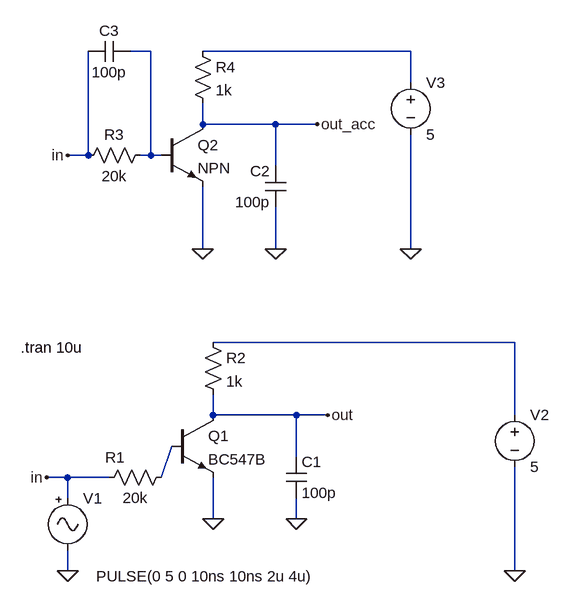
[diagram p0: schematic 3.7.asc]
3.7.asc, the LTspice schematic file:
Version 4
SHEET 1 880 936
WIRE 16 -32 -16 -32
WIRE 416 -32 96 -32
WIRE 416 16 416 -32
WIRE 96 80 96 48
WIRE 208 80 96 80
WIRE 272 80 208 80
WIRE -80 128 -80 -32
WIRE -80 128 -112 128
WIRE 16 128 16 -32
WIRE 16 128 0 128
WIRE 32 128 16 128
WIRE 208 144 208 80
WIRE 96 272 96 176
WIRE 208 272 208 208
WIRE 416 272 416 96
WIRE 576 416 112 416
WIRE 112 528 112 496
WIRE 240 528 112 528
WIRE 288 528 240 528
WIRE 576 528 576 416
WIRE 240 592 240 528
WIRE -112 624 -144 624
WIRE -48 624 -112 624
WIRE 32 624 48 576
WIRE -112 656 -112 624
WIRE 112 688 112 624
WIRE 240 688 240 656
WIRE -112 768 -112 736
WIRE 576 768 576 608
FLAG 96 272 0
FLAG 208 272 0
FLAG 416 272 0
FLAG -112 128 in
FLAG 272 80 out_acc
FLAG -112 768 0
FLAG 112 688 0
FLAG 240 688 0
FLAG 576 768 0
FLAG -144 624 in
FLAG 288 528 out
SYMBOL res 16 112 R90
WINDOW 0 0 56 VBottom 2
WINDOW 3 32 56 VTop 2
SYMATTR InstName R3
SYMATTR Value 20k
SYMBOL res 80 -48 R0
SYMATTR InstName R4
SYMATTR Value 1k
SYMBOL voltage 416 0 R0
WINDOW 123 0 0 Left 2
WINDOW 39 0 0 Left 2
SYMATTR InstName V3
SYMATTR Value 5
SYMBOL cap 224 208 R180
WINDOW 0 24 56 Left 2
WINDOW 3 24 8 Left 2
SYMATTR InstName C2
SYMATTR Value 100p
SYMBOL npn 32 80 R0
SYMATTR InstName Q2
SYMBOL cap -16 -48 R90
WINDOW 0 0 32 VBottom 2
WINDOW 3 32 32 VTop 2
SYMATTR InstName C3
SYMATTR Value 100p
SYMBOL Misc\\signal -112 640 R0
WINDOW 123 0 0 Left 2
WINDOW 39 0 0 Left 2
WINDOW 3 44 136 Left 2
SYMATTR InstName V1
SYMATTR Value PULSE(0 5 0 10ns 10ns 2u 4u)
SYMBOL res 48 608 R90
WINDOW 0 1 87 VBottom 2
WINDOW 3 32 56 VTop 2
SYMATTR InstName R1
SYMATTR Value 20k
SYMBOL res 96 400 R0
SYMATTR InstName R2
SYMATTR Value 1k
SYMBOL voltage 576 512 R0
WINDOW 123 0 0 Left 2
WINDOW 39 0 0 Left 2
SYMATTR InstName V2
SYMATTR Value 5
SYMBOL cap 224 592 R0
SYMATTR InstName C1
SYMATTR Value 100p
SYMBOL npn 48 528 R0
SYMATTR InstName Q1
SYMATTR Value BC547B
TEXT -184 424 Left 2 !.tran 10u

The netlist it stands for:
* 3.7.asc
R3 N001 in 20k
R4 N002 out_acc 1k
V3 N002 0 5
C2 0 out_acc 100p
Q2 out_acc N001 0 0 NPN
C3 N001 in 100p
V1 in 0 PULSE(0 5 0 10ns 10ns 2u 4u)
R1 N004 in 20k
R2 N003 out 1k
V2 N003 0 5
C1 out 0 100p
Q1 out N004 0 0 BC547B
.model NPN NPN
.model PNP PNP
.lib standard.bjt
.tran 10u
.backanno
.end